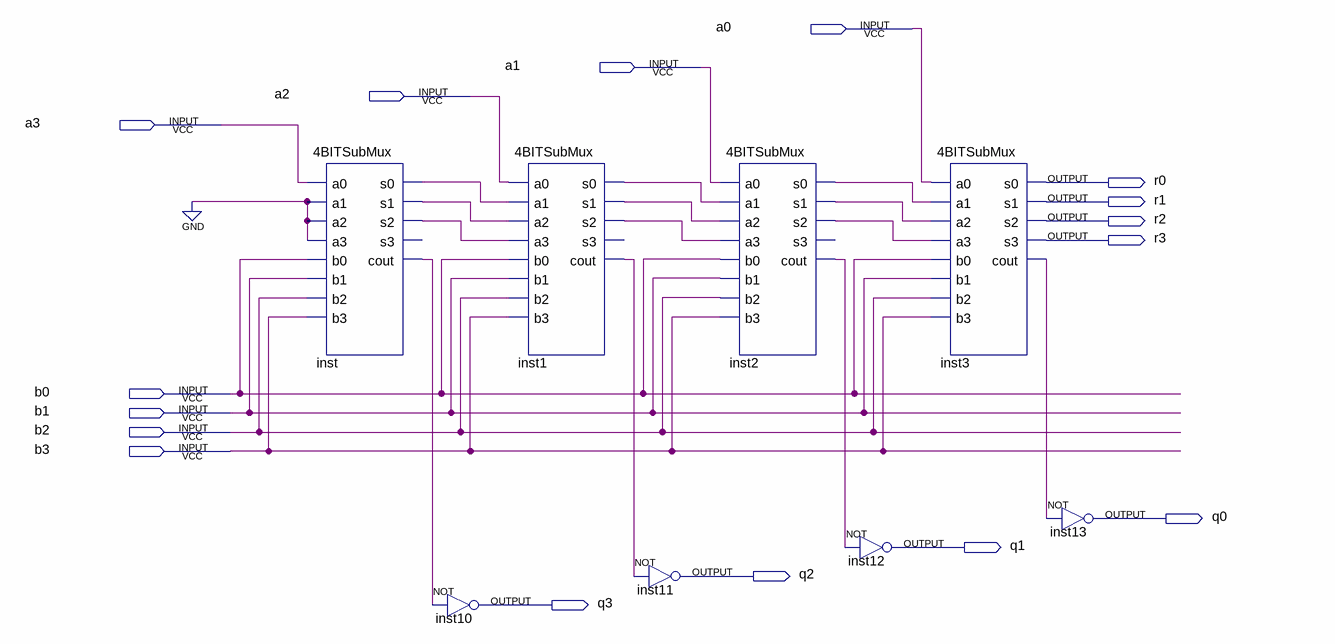
[diagram p0: schematic sheet]
// Quartus schematic Divider.bdf as structural Verilog: 8 symbols, 16 pins
module Divider (
  input  a0,
  input  a1,
  input  a2,
  input  a3,
  input  b0,
  input  b1,
  input  b2,
  input  b3,
  output r0,
  output r1,
  output r2,
  output r3,
  output q0,
  output q1,
  output q2,
  output q3
);

  wire inst1_cout, inst1_s0, inst1_s1, inst1_s2, inst2_cout, inst2_s0, inst2_s1, inst2_s2, inst3_cout,
       inst_cout, inst_s0, inst_s1, inst_s2;

  \4BITSubMux  inst (
    .a0(a3), .a1(1'b0), .a2(1'b0), .a3(1'b0), .b0(b0), .b1(b1), .b2(b2), .b3(b3), .s0(inst_s0), .s1(inst_s1),
    .s2(inst_s2), .cout(inst_cout));  // open: s3
  not inst10 (q3, inst_cout);
  \4BITSubMux  inst1 (
    .a0(a2), .a1(inst_s0), .a2(inst_s1), .a3(inst_s2), .b0(b0), .b1(b1), .b2(b2), .b3(b3), .s0(inst1_s0),
    .s1(inst1_s1), .s2(inst1_s2), .cout(inst1_cout));  // open: s3
  not inst11 (q2, inst1_cout);
  \4BITSubMux  inst2 (
    .a0(a1), .a1(inst1_s0), .a2(inst1_s1), .a3(inst1_s2), .b0(b0), .b1(b1), .b2(b2), .b3(b3), .s0(inst2_s0),
    .s1(inst2_s1), .s2(inst2_s2), .cout(inst2_cout));  // open: s3
  not inst12 (q1, inst2_cout);
  \4BITSubMux  inst3 (
    .a0(a0), .a1(inst2_s0), .a2(inst2_s1), .a3(inst2_s2), .b0(b0), .b1(b1), .b2(b2), .b3(b3), .s0(r0),
    .s1(r1), .s2(r2), .s3(r3), .cout(inst3_cout));
  not inst13 (q0, inst3_cout);
endmodule
